# EasyEDA schematic SCH_opticaltoqwiic_2024-08-06.json
TITLE: Sheet_1; REV: 1.0; Date: 2024-08-06; Sheet: 1/1; Drawn By: kavinm; Company: Your Company
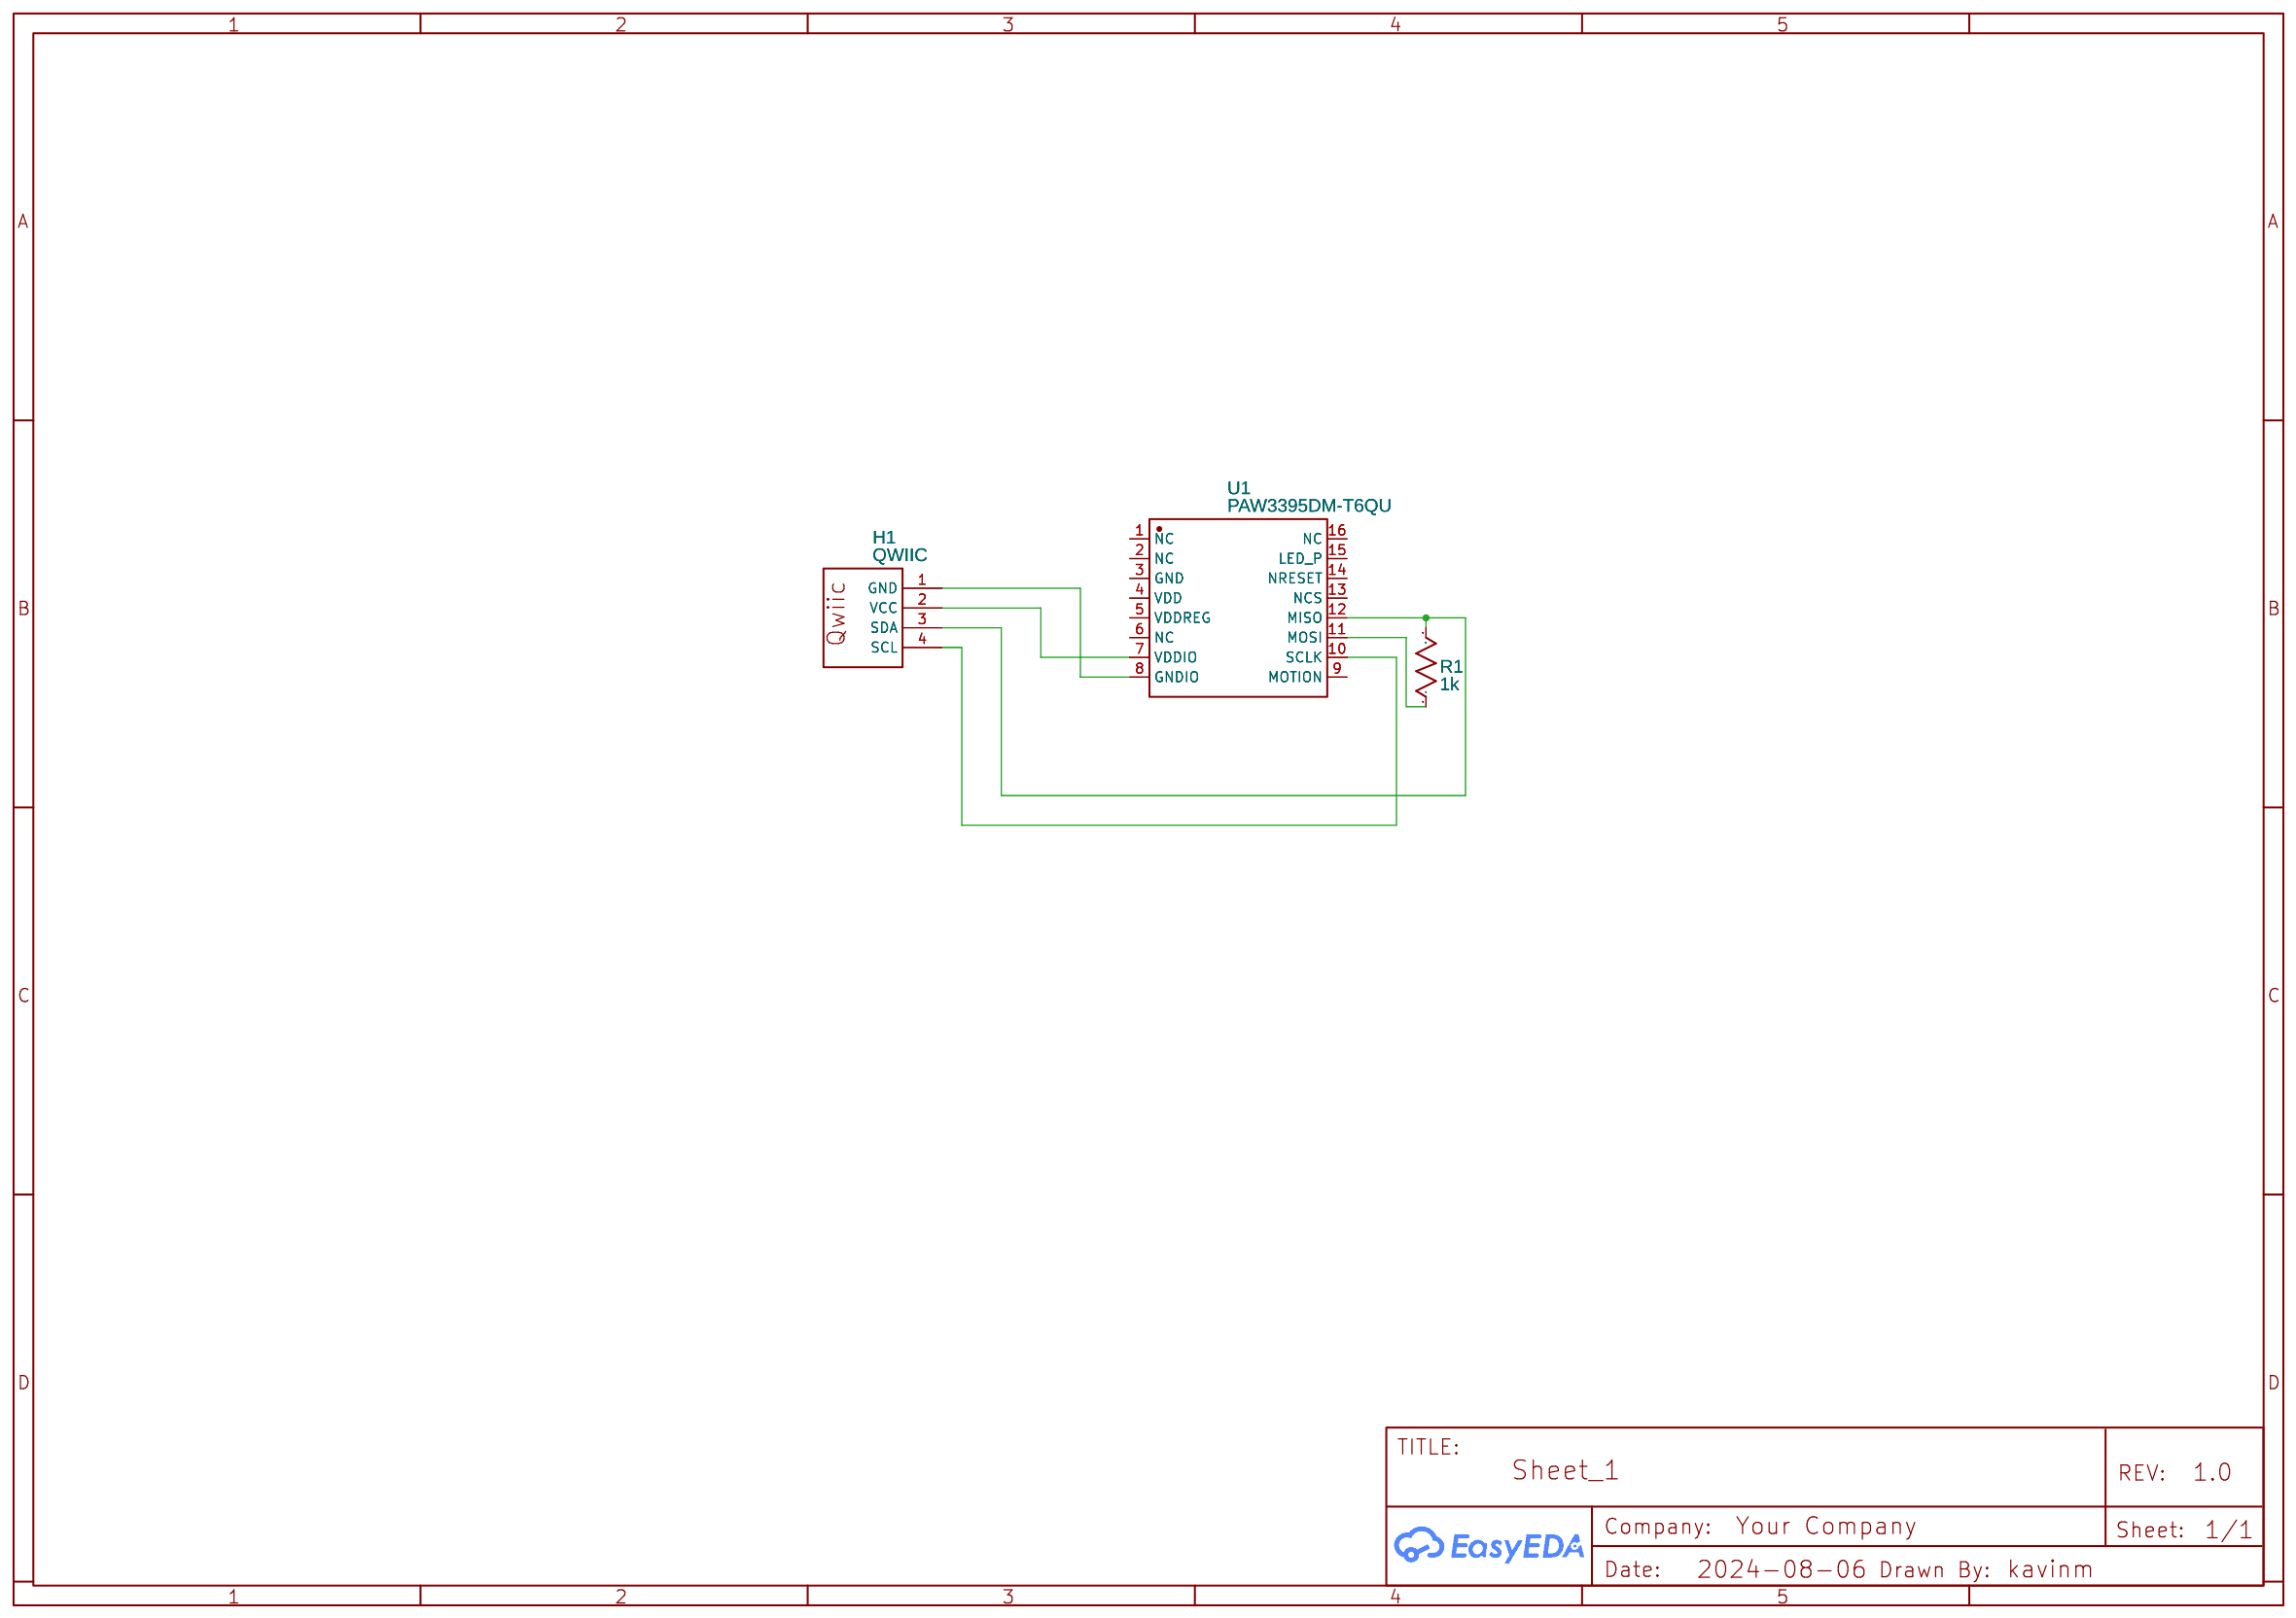
[diagram p0: schematic sheet]

## Parts
H1  QWIIC  [QWIIC]
R1  1k  [R0603]
U1  PAW3395DM-T6QU  [DIP-16_PAW3395DM-T6QU]

## Library data of the parts
H1 = QWIIC: Contributor: gdepiedoue
R1 = R_0603_US: Contributor: LCEDA_Lib
U1 = PAW3395DM-T6QU: Contributor: lcsc; Supplier: LCSC; Supplier Part: C9900026543; Manufacturer: null

## Nets
Net-(H1-1): H1.1(GND) U1.8(GNDIO)
Net-(H1-2): H1.2(VCC) U1.7(VDDIO)
Net-(H1-3): H1.3(SDA) R1.2 U1.12(MISO)
Net-(H1-4): H1.4(SCL) U1.10(SCLK)
Net-(R1-1): R1.1 U1.11(MOSI)

Not connected (* = marked no-connect by the designer): U1 1(NC) 2(NC) 3(GND) 4(VDD) 5(VDDREG) 6(NC) 9(MOTION) 13(NCS) 14(NRESET) 15(LED_P) 16(NC)
